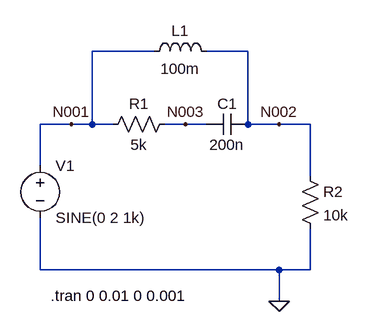
[diagram p0: schematic parallel_testing.asc]
parallel_testing.asc, the LTspice schematic file:
Version 4
SHEET 1 880 680
WIRE 256 -48 160 -48
WIRE 400 -48 336 -48
WIRE 128 64 80 64
WIRE 160 64 160 -48
WIRE 160 64 128 64
WIRE 192 64 160 64
WIRE 304 64 272 64
WIRE 336 64 304 64
WIRE 400 64 400 -48
WIRE 448 64 400 64
WIRE 496 64 448 64
WIRE 80 128 80 64
WIRE 496 144 496 64
WIRE 80 288 80 208
WIRE 448 288 80 288
WIRE 496 288 496 224
WIRE 496 288 448 288
WIRE 448 336 448 288
FLAG 448 336 0
FLAG 128 64 N001
FLAG 304 64 N003
FLAG 448 64 N002
SYMBOL voltage 80 112 R0
WINDOW 123 0 0 Left 0
WINDOW 39 0 0 Left 0
SYMATTR InstName V1
SYMATTR Value SINE(0 2 1k)
SYMBOL res 288 48 R90
WINDOW 0 0 56 VBottom 2
WINDOW 3 32 56 VTop 2
SYMATTR InstName R1
SYMATTR Value 5k
SYMBOL cap 400 48 R90
WINDOW 0 0 32 VBottom 2
WINDOW 3 32 32 VTop 2
SYMATTR InstName C1
SYMATTR Value 200n
SYMBOL ind 240 -32 R270
WINDOW 0 32 56 VTop 2
WINDOW 3 5 56 VBottom 2
SYMATTR InstName L1
SYMATTR Value 100m
SYMBOL res 480 128 R0
SYMATTR InstName R2
SYMATTR Value 10k
TEXT 96 328 Left 2 !.tran 0 0.01 0 0.001

The netlist it stands for:
* parallel_testing.asc
V1 N001 0 SINE(0 2 1k)
R1 N003 N001 5k
C1 N002 N003 200n
L1 N001 N002 100m
R2 N002 0 10k
.tran 0 0.01 0 0.001
.backanno
.end